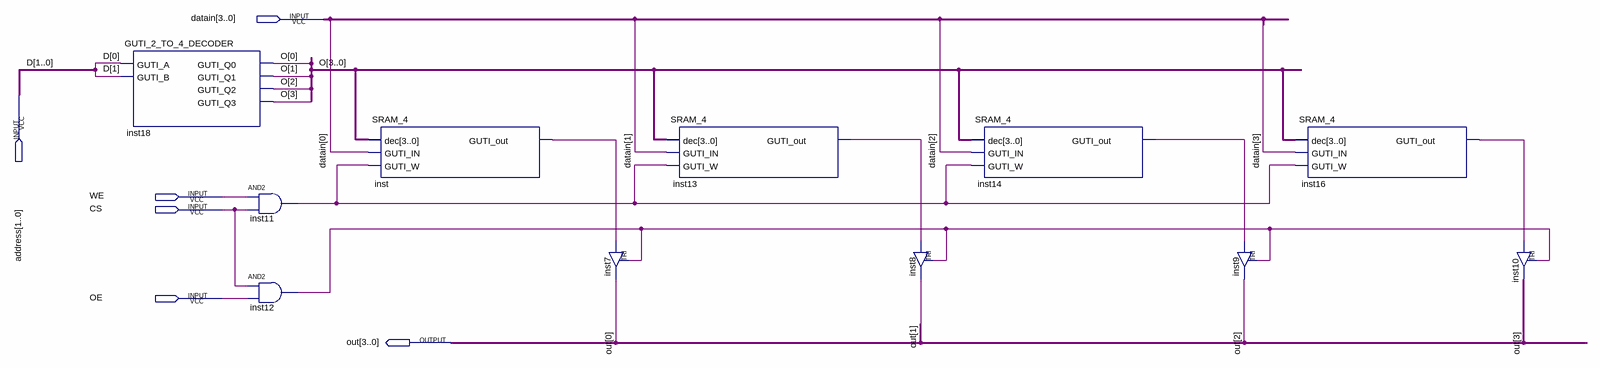
[diagram p0: schematic sheet]
// Quartus schematic SRAM_4x4.bdf as structural Verilog: 11 symbols, 6 pins
module SRAM_4x4 (
  input  [3:0] datain,
  input  [1:0] address,
  input  WE,
  input  CS,
  input  OE,
  output [3:0] out
);

  wire inst11_out, inst12_out, inst13_guti_out, inst14_guti_out, inst16_guti_out, inst_guti_out;
  wire [3:0] O;

  GUTI_2_TO_4_DECODER inst18 (
    .GUTI_A(address[0]), .GUTI_B(address[1]), .GUTI_Q0(O[0]), .GUTI_Q1(O[1]), .GUTI_Q2(O[2]), .GUTI_Q3(O[3]));
  and inst11 (inst11_out, WE, CS);
  and inst12 (inst12_out, CS, OE);
  SRAM_4 inst (.dec(O), .GUTI_IN(datain[0]), .GUTI_W(inst11_out), .GUTI_out(inst_guti_out));
  TRI inst7 (.IN(inst_guti_out), .OE(inst12_out), .OUT(out[0]));
  SRAM_4 inst13 (.dec(O), .GUTI_IN(datain[1]), .GUTI_W(inst11_out), .GUTI_out(inst13_guti_out));
  TRI inst8 (.IN(inst13_guti_out), .OE(inst12_out), .OUT(out[1]));
  SRAM_4 inst14 (.dec(O), .GUTI_IN(datain[2]), .GUTI_W(inst11_out), .GUTI_out(inst14_guti_out));
  TRI inst9 (.IN(inst14_guti_out), .OE(inst12_out), .OUT(out[2]));
  SRAM_4 inst16 (.dec(O), .GUTI_IN(datain[3]), .GUTI_W(inst11_out), .GUTI_out(inst16_guti_out));
  TRI inst10 (.IN(inst16_guti_out), .OE(inst12_out), .OUT(out[3]));

  // Other names for the same wires on the sheet: D[1:0] = address
endmodule
